# Altium schematic sheet MCU_Board_2021-08-30.schdoc
size 177 x 129 mm
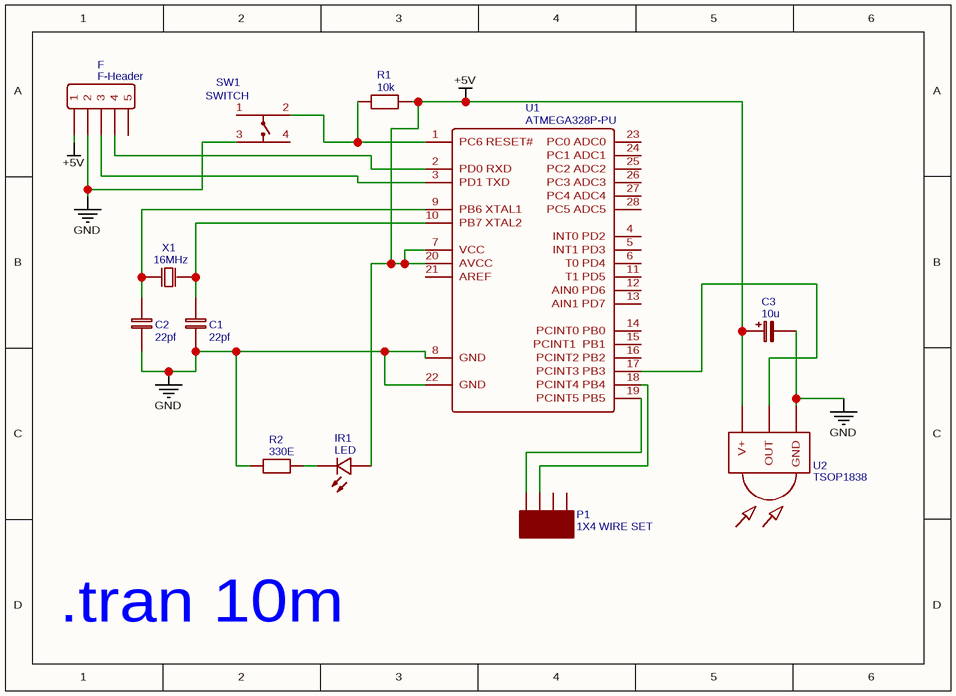
[diagram p0: MCU_Board_2021-08-30.schdoc]

## Parts
C1  22pf  [CERAMIC-2.54]
C2  22pf  [CERAMIC-2.54]
C3  10u  [CAP-D3.0×F1.5]
F  F-Header  [HDR-5X1/2.54]
IR1  LED  [LED-TH_BD5.0-P2.54-FD]
P1  1X4 WIRE SET  [HDR-4X1/2.54]
R1  10k  [AXIAL-0.2-MFR-12]
R2  330E  [AXIAL-0.2-MFR-12]
SW1  SWITCH  [TACT_SW_6X6X8_SMD]
U1  ATMEGA328P-PU  [DIP-28_L34.6-W7.3-P2.54-LS10.2-BL]
U2  TSOP1838  [TSOP18XX]
X1  16MHz  [HC-49US_L11.5-W4.5-P4.88]

## Nets
+5V: C3.1 F.1 IR1.1(A) R1.2 U1.7(VCC) U1.20(AVCC) U2.VCC(V+)
GND: C1.2 C2.2 C3.2 F.2 R2.2 SW1.3 U1.8(GND) U1.22(GND) U2.GND
NetC1_1: C1.1 U1.10(PB7_XTAL2) X1.2(OSC2)
NetC2_1: C2.1 U1.9(PB6_XTAL1) X1.1(OSC1)
NetF_3: F.3 U1.3(PD1_TXD)
NetF_4: F.4 U1.2(PD0_RXD)
NetIR1_2: IR1.2(C) R2.1
NetP1_3: P1.3(4) U1.19(PCINT5_PB5)
NetP1_4: P1.4(3) U1.18(PCINT4_PB4)
NetR1_1: R1.1 SW1.2 U1.1(PC6_RESET#)
NetU1_17: U1.17(PCINT3_PB3) U2.OUT

Not connected (* = marked no-connect by the designer): F 5; P1 1 2; SW1 1 4; U1 4(INT0_PD2) 5(INT1_PD3) 6(T0_PD4) 11(T1_PD5) 12(AIN0_PD6) 13(AIN1_PD7) 14(PCINT0_PB0) 15(PCINT1__PB1) 16(PCINT2_PB2) 21(AREF) 23(PC0_ADC0) 24(PC1_ADC1) 25(PC2_ADC2) 26(PC3_ADC3) 27(PC4_ADC4) 28(PC5_ADC5)

## Notes on the sheet
- .tran 10m

## Library data of the parts
C1 C2 = 22pf: nameAlias: Value(F); Contributor: LCEDA_Lib; spicePre: C; spiceSymbolName: C_0603_EU
C3 = 10u: nameAlias: Value(F); Contributor: LCEDA_Lib; spicePre: C; spiceSymbolName: CE_TH_D3.0×F1.5_EU
F = F-Header: Contributor: dfemery; spicePre: P; spiceSymbolName: HDR-5x1/2.54
IR1 = LED: BOM_Manufacturer: EVERLIGHT; BOM_Manufacturer Part: IR333C/H0/L10; BOM_Supplier: LCSC; BOM_Supplier Part: C72053; BOM_JLCPCB Part Class: Extended Part; spicePre: I; spiceSymbolName: IR333C/H0/L10
P1 = 1X4 WIRE SET: BOM_Manufacturer: LCSC; BOM_Manufacturer Part: Header-Female-2.54_1x4; BOM_Supplier Part: C44527; BOM_Supplier: LCSC; spicePre: P; spiceSymbolName: 1X4 WIRE SET
R1 = 10k: nameAlias: Value(Ω); Contributor: LCEDA_Lib; spicePre: R; spiceSymbolName: R_0603_EU
R2 = 330E: nameAlias: Value(Ω); Contributor: LCEDA_Lib; spicePre: R; spiceSymbolName: R_0603_EU
SW1 = SWITCH: nameAlias: Model; catid: 20; Contributor: Moile-EasyEDA; sim: true; spicePre: X; spiceSymbolName: TACTILE_SWITCH_SMD_6x6
U1 = ATMEGA328P-PU: BOM_Manufacturer: MICROCHIP; sourceId: Oic6oiASL; Contributor: LCSC; timeStamp: 1451725987; BOM_Supplier: LCSC; BOM_Manufacturer Part: ATMEGA328P-PU; BOM_Supplier Part: C33901; BOM_JLCPCB Part Class: Extended Part; spicePre: U; spiceSymbolName: ATMEGA328P-PU
X1 = 16MHz: BOM_Manufacturer: HOSONIC; BOM_Manufacturer Part: E49A16E00000KE10CO; nameAlias: Frequency; BOM_Supplier: LCSC; BOM_Supplier Part: C114981; BOM_JLCPCB Part Class: Extended Part; spicePre: X; spiceSymbolName: E49A16E00000KE10CO
U2 = TSOP1838: spicePre: U; spiceSymbolName: TSOP1838